# EasyEDA schematic SCH_LoRaRice(Gateway)_2024-05-29.json
TITLE: Gateway PCB; REV: 1.0; Date: 2024-05-26; Sheet: 1/1; Drawn By: Teeraphat Thongchern; Company: LoRaRice_Gateway
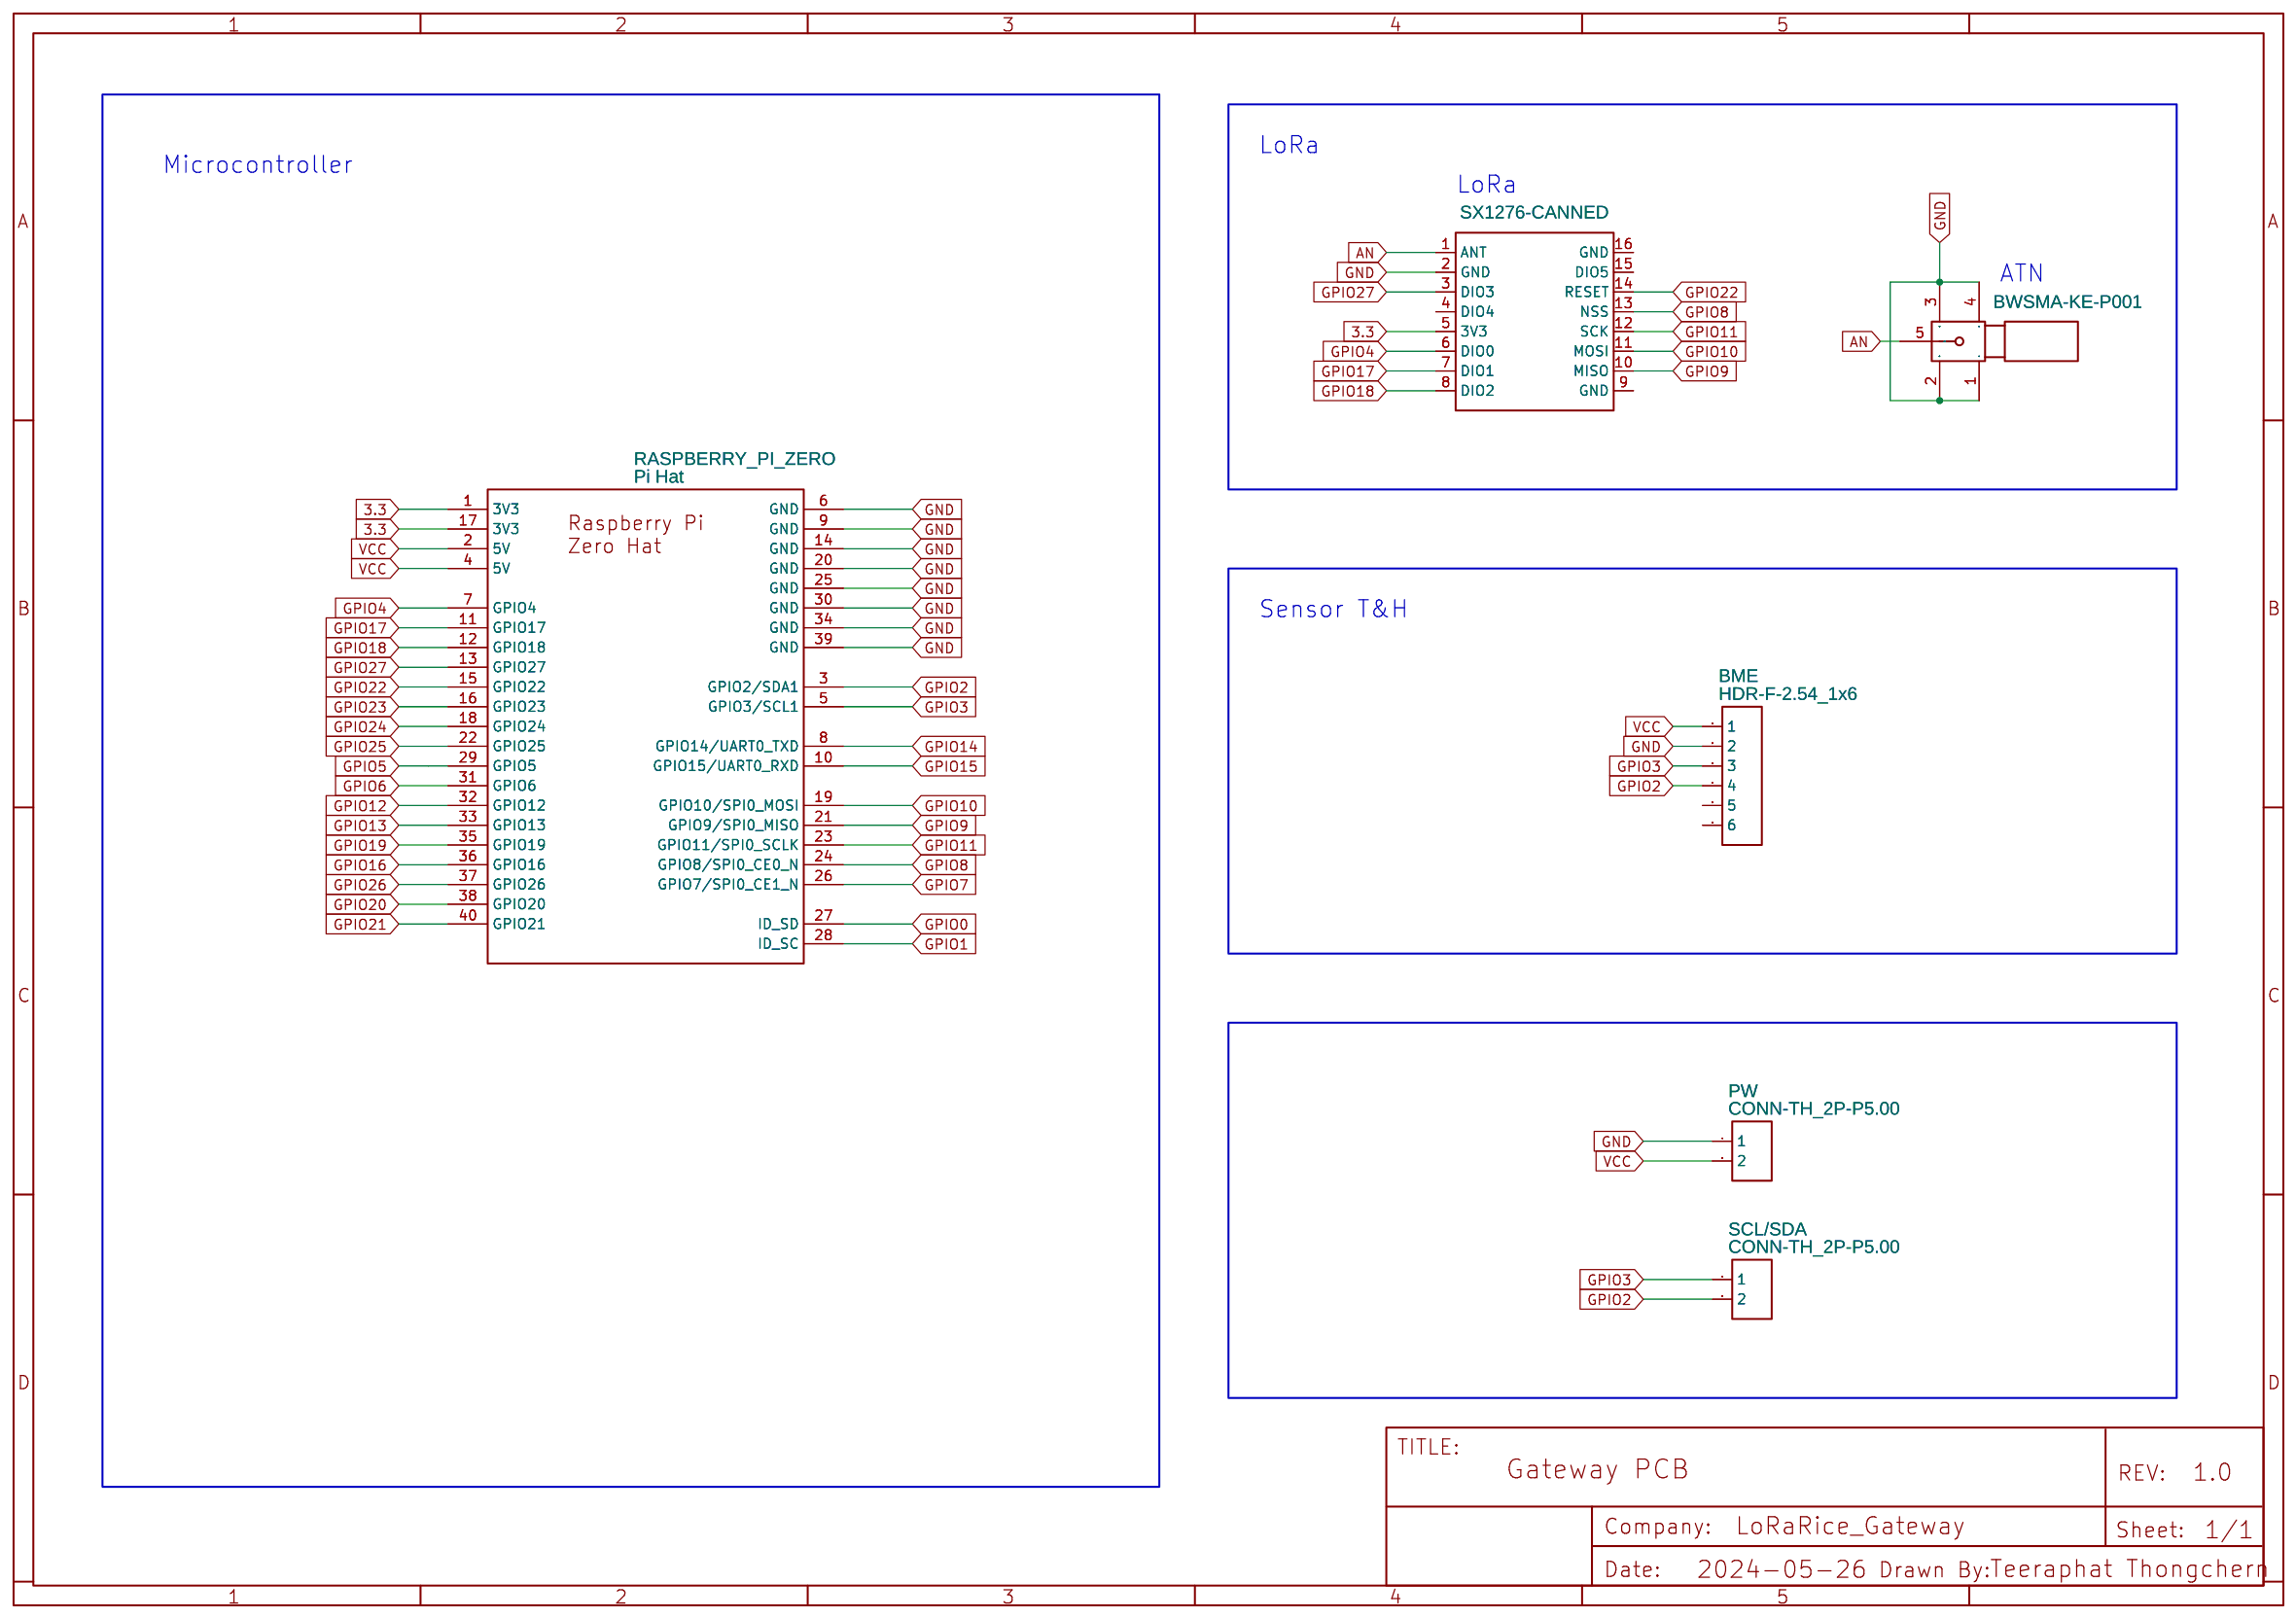
[diagram p0: schematic sheet]

## Parts
ATN  BWSMA-KE-P001  [SMA-SMD_BWSMA-KE-P001]
BME  HDR-F-2.54_1x6  [HDR-F-2.54_1X6]
LORA  SX1276-CANNED  [SX1276-CANNED]
PW  CONN-TH_2P-P5.00  [CONN-TH_2P-P5.00]
RASPBERRY_PI_ZERO  Pi Hat  [RASPBERRY_PI_ZERO_HAT]
SCL/SDA  CONN-TH_2P-P5.00  [CONN-TH_2P-P5.00]

## Library data of the parts
ATN = BWSMA-KE-P001: Contributor: LCSC; Supplier: LCSC; Supplier Part: C496550; Manufacturer: BAT WIRELESS(蝙蝠无线); JLCPCB Part Class: Extended Part
BME = HDR-F-2.54_1x6: Supplier Part: C40877; Supplier: LCSC; Contributor: LCEDA_Lib
LORA = SX1276-CANNED: Manufacturer: G-NiceRF; Manufacturer Part: LoRa1276-C1; Supplier: Banggood; Supplier Part: Unknown; link: https://uk.banggood.com/LoRa1276-C1-SX1276-868MHz-LoRa-Module-Remote-Spread-Spectrum-Wireless-Module-20dBm-100mW-3-5KM-p-1416393.html?gmcCountry=GB¤cy=GBP&createTmp=1&utm_source=googleshopping&utm_medium=cpc_bgcs&utm_content=garman&utm_campaign=pla-gbg-ele-pc&gclid=EAIaIQobChMIouzku5XS4gIVipTtCh1cvgo9EAYYByABEgJIPfD_BwE&cur_warehouse=CN; Contributor: P-Thomsen
PW SCL/SDA = CONN-TH_2P-P5.00: Supplier: LCSC; Contributor: LCEDA_Lib
RASPBERRY_PI_ZERO = RPI ZERO 2W: Manufacturer: Raspberry Pi Foundation; Contributor: Patrick Schurig

## Nets
GND: ATN.1 ATN.2 ATN.3 ATN.4 BME.2 LORA.2(GND) PW.1 RASPBERRY_PI_ZERO.6(GND) RASPBERRY_PI_ZERO.9(GND) RASPBERRY_PI_ZERO.14(GND) RASPBERRY_PI_ZERO.20(GND) RASPBERRY_PI_ZERO.25(GND) RASPBERRY_PI_ZERO.30(GND) RASPBERRY_PI_ZERO.34(GND) RASPBERRY_PI_ZERO.39(GND)
VCC: BME.1 PW.2 RASPBERRY_PI_ZERO.2(5V) RASPBERRY_PI_ZERO.4(5V)
3.3: LORA.5(3V3) RASPBERRY_PI_ZERO.1(3V3) RASPBERRY_PI_ZERO.17(3V3)
AN: ATN.5 LORA.1(ANT)
GPIO0: RASPBERRY_PI_ZERO.27(ID_SD)
GPIO1: RASPBERRY_PI_ZERO.28(ID_SC)
GPIO2: BME.4 RASPBERRY_PI_ZERO.3(GPIO2/SDA1) SCL/SDA.2
GPIO3: BME.3 RASPBERRY_PI_ZERO.5(GPIO3/SCL1) SCL/SDA.1
GPIO4: LORA.6(DIO0) RASPBERRY_PI_ZERO.7(GPIO4)
GPIO5: RASPBERRY_PI_ZERO.29(GPIO5)
GPIO6: RASPBERRY_PI_ZERO.31(GPIO6)
GPIO7: RASPBERRY_PI_ZERO.26(GPIO7/SPI0_CE1_N)
GPIO8: LORA.13(NSS) RASPBERRY_PI_ZERO.24(GPIO8/SPI0_CE0_N)
GPIO9: LORA.10(MISO) RASPBERRY_PI_ZERO.21(GPIO9/SPI0_MISO)
GPIO10: LORA.11(MOSI) RASPBERRY_PI_ZERO.19(GPIO10/SPI0_MOSI)
GPIO11: LORA.12(SCK) RASPBERRY_PI_ZERO.23(GPIO11/SPI0_SCLK)
GPIO12: RASPBERRY_PI_ZERO.32(GPIO12)
GPIO13: RASPBERRY_PI_ZERO.33(GPIO13)
GPIO14: RASPBERRY_PI_ZERO.8(GPIO14/UART0_TXD)
GPIO15: RASPBERRY_PI_ZERO.10(GPIO15/UART0_RXD)
GPIO16: RASPBERRY_PI_ZERO.36(GPIO16)
GPIO17: LORA.7(DIO1) RASPBERRY_PI_ZERO.11(GPIO17)
GPIO18: LORA.8(DIO2) RASPBERRY_PI_ZERO.12(GPIO18)
GPIO19: RASPBERRY_PI_ZERO.35(GPIO19)
GPIO20: RASPBERRY_PI_ZERO.38(GPIO20)
GPIO21: RASPBERRY_PI_ZERO.40(GPIO21)
GPIO22: LORA.14(RESET) RASPBERRY_PI_ZERO.15(GPIO22)
GPIO23: RASPBERRY_PI_ZERO.16(GPIO23)
GPIO24: RASPBERRY_PI_ZERO.18(GPIO24)
GPIO25: RASPBERRY_PI_ZERO.22(GPIO25)
GPIO26: RASPBERRY_PI_ZERO.37(GPIO26)
GPIO27: LORA.3(DIO3) RASPBERRY_PI_ZERO.13(GPIO27)

Not connected (* = marked no-connect by the designer): BME 5 6; LORA 4(DIO4) 9(GND) 15(DIO5) 16(GND)

## Notes on the sheet
- LoRa
- Microcontroller
- LoRa
- ATN
- Sensor T&H
